# Altium schematic sheet Joystick.SchDoc: Joystick (Wacky Races)
size A3; Author: Harry Dobbs; Address1: ECE Department; Address2: University of Canterbury; Address3: Christchurch 8041; Address4: New Zealand; Revision: 1
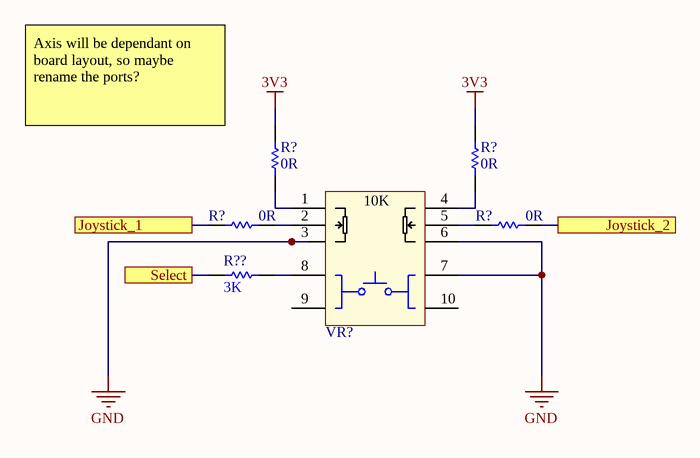
[diagram p0: Joystick.SchDoc]

## Parts
(Parts that share a designator on the sheet are numbered #1, #2 ... from top to bottom, then left to right.)
R?#1  0R  [RESC1608L]
R?#2  0R  [RESC1608L]
R?#3  0R  [RESC1608L]
R?#4  0R  [RESC1608L]
R??  3K  [RESC1608L]
VR?  Joystick 10k with Sw  [Joystick_Sw]  (value not drawn)

## Ports
Joystick_1, Joystick_2, Select

## Nets
3V3: R?#1.2 R?#2.2
GND: VR?.3 VR?.6(3') VR?.7
Joystick_1: R?#3.1 ; port Joystick_1
Joystick_2: R?#4.2 ; port Joystick_2
Select: R??.1 ; port Select
NetR?#1_1: R?#1.1 VR?.1
NetR?#2_1: R?#2.1 VR?.4(1')
NetR?#3_2: R?#3.2 VR?.2
NetR?#4_1: R?#4.1 VR?.5(2')
NetR??_2: R??.2 VR?.8

Not connected (* = marked no-connect by the designer): VR? 9 10

## Notes on the sheet
- (near R?#1) Axis will be dependant on board layout, so maybe rename the ports?
- Title
- Drawn by:
- Date:
- Time:
- Revision:
- Sheet
- of
- File:
- (in symbol Joystick 10k with Sw) 10K

## Library data of the parts
R?#1-R?#4 = RS_0R0: RES 0.0 OHM 1/10W 5% 0603 SMD; Storage Location: PCB Assembly WS; Supplier: ECE Dept; Value: 0R
R?? = RS_3K: RES 3K OHM 1/10W 5% 0603 SMD; Storage Location: PCB Assembly WS; Supplier: ECE Dept; Value: 3K
VR? = Joystick 10k with Sw: JOYSTICK 10K OHM 2 AXIS TH; Manufacturer 1: SparkFun; Manufacturer Part Number 1: COM-09032; Supplier 1: Digi-Key; Stock 1: 563; Pricing 1: 1=3.95000 (USD); RoHS: No; ComponentLink1URL: https://media.digikey.com/pdf/Data%20Sheets/Sparkfun%20PDFs/COM-09032_Web.pdf?src-supplier=Digi-Key; ComponentLink1Description: https://media.digikey.com/pdf/Data%20Sheets/Sparkfun%20PDFs/COM-09032_Web.pdf?src-supplier=Digi-Key; Supplier Part Number 1: 1568-1526-ND